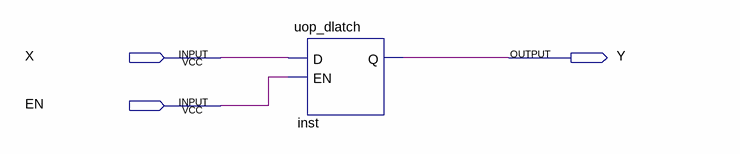
[diagram p0: schematic sheet]
// Quartus schematic behavioural.bdf as structural Verilog: 1 symbols, 3 pins
module behavioural (
  input  X,
  input  EN,
  output Y
);

  uop_dlatch inst (.D(X), .EN(EN), .Q(Y));
endmodule
